# EAGLE schematic SP-PC-1 (EAGLE 7.6.0)

## Sheet 1 of 8: SP
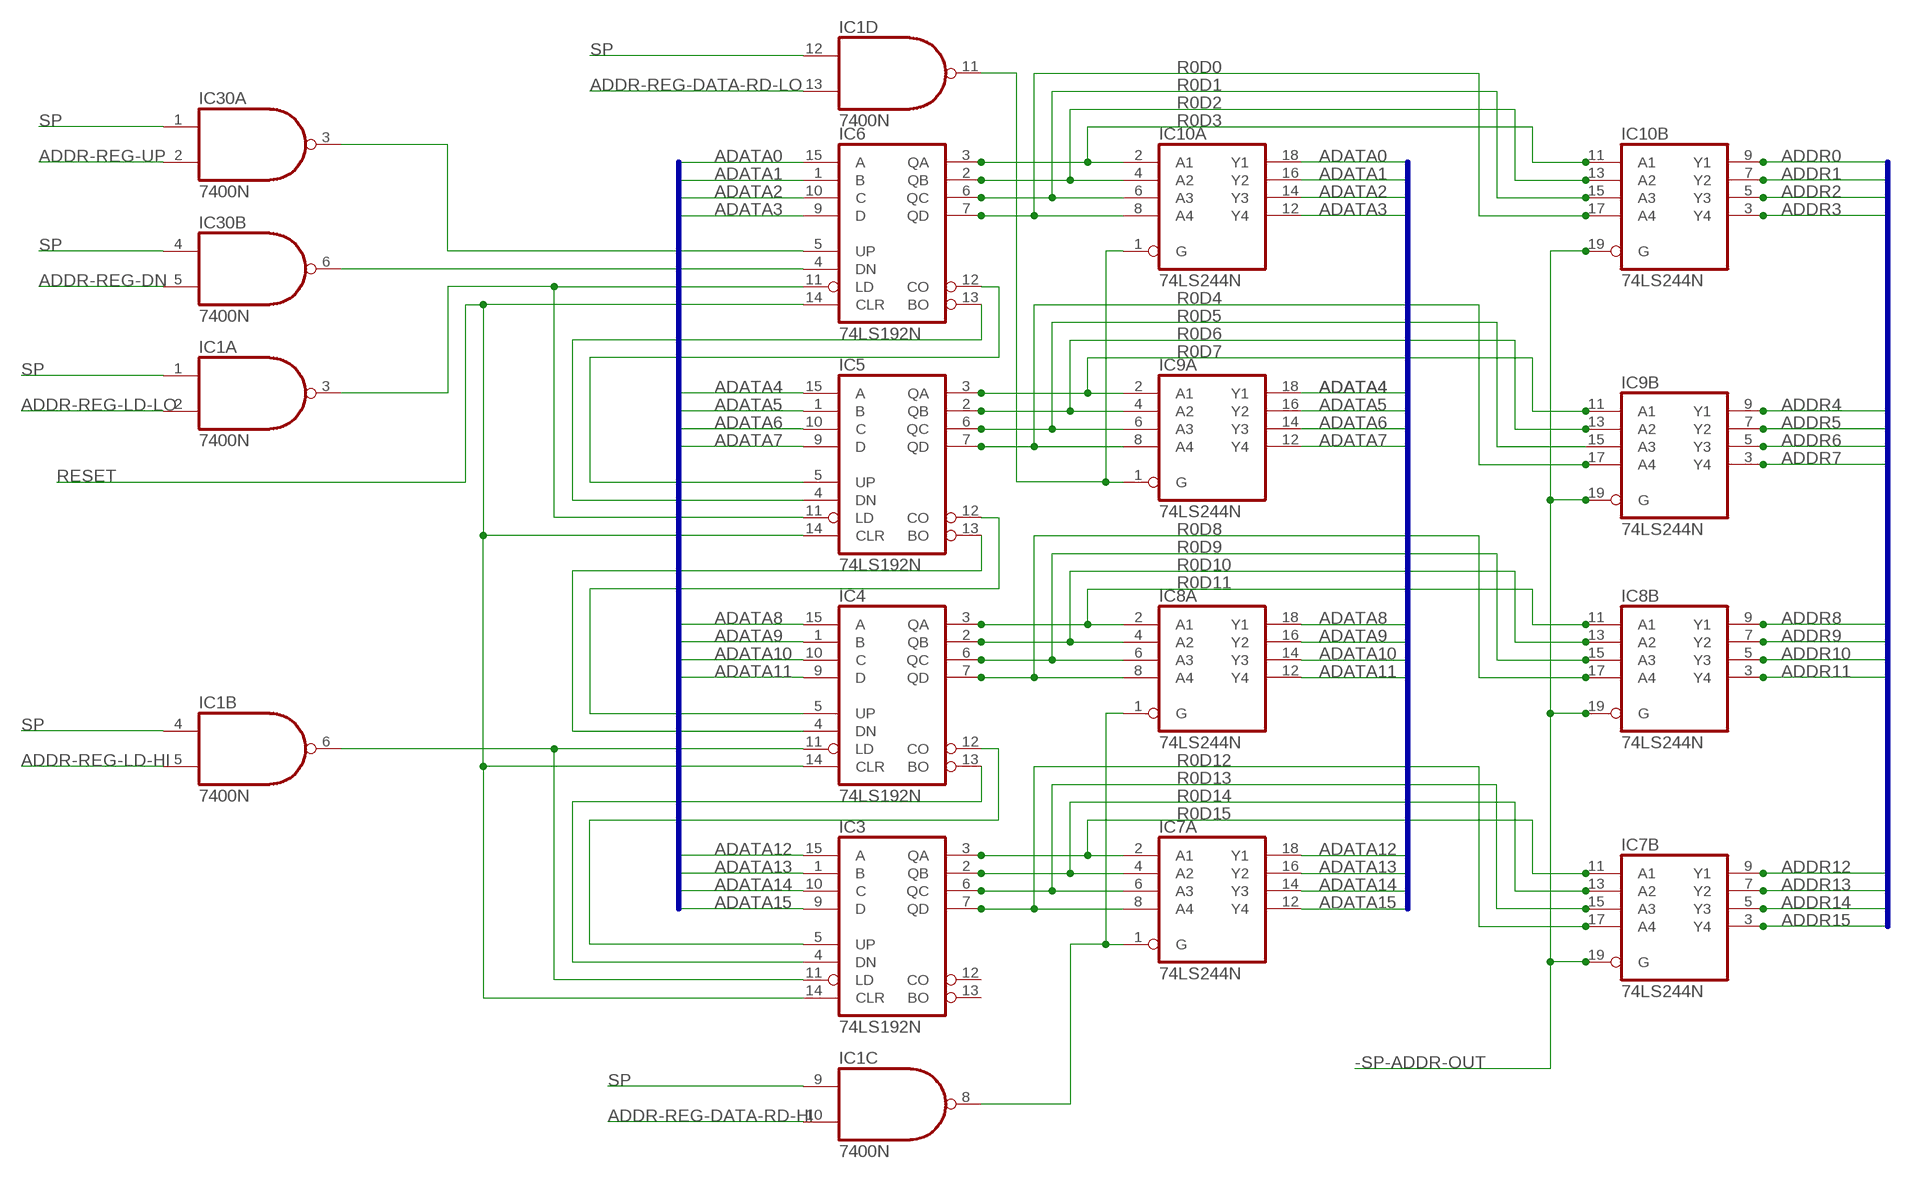
[diagram p0: schematic, sheet 1]

### Parts
IC1  7400N  [DIL14]
IC3  74LS192N  [DIL16]
IC4  74LS192N  [DIL16]
IC5  74LS192N  [DIL16]
IC6  74LS192N  [DIL16]
IC7  74LS244N  [DIL20]
IC8  74LS244N  [DIL20]
IC9  74LS244N  [DIL20]
IC10  74LS244N  [DIL20]
IC30  7400N  [DIL14]

### Nets
-SP-ADDR-OUT: IC7.19(B:G) IC8.19(B:G) IC9.19(B:G) IC10.19(B:G) ; also sheet 5
ADATA0: IC6.15(A) IC10.18(A:Y1) ; also sheet 2,3,4,5,7
ADATA1: IC6.1(B) IC10.16(A:Y2) ; also sheet 2,3,4,5,7
ADATA2: IC6.10(C) IC10.14(A:Y3) ; also sheet 2,3,4,5,7
ADATA3: IC6.9(D) IC10.12(A:Y4) ; also sheet 2,3,4,5,7
ADATA4: IC5.15(A) IC9.18(A:Y1) ; also sheet 2,3,4,5,7
ADATA5: IC5.1(B) IC9.16(A:Y2) ; also sheet 2,3,4,5,7
ADATA6: IC5.10(C) IC9.14(A:Y3) ; also sheet 2,3,4,5,7
ADATA7: IC5.9(D) IC9.12(A:Y4) ; also sheet 2,3,4,5,7
ADATA8: IC4.15(A) IC8.18(A:Y1) ; also sheet 2,3,4,5,7
ADATA9: IC4.1(B) IC8.16(A:Y2) ; also sheet 2,3,4,5,7
ADATA10: IC4.10(C) IC8.14(A:Y3) ; also sheet 2,3,4,5,7
ADATA11: IC4.9(D) IC8.12(A:Y4) ; also sheet 2,3,4,5,7
ADATA12: IC3.15(A) IC7.18(A:Y1) ; also sheet 2,3,4,5,7
ADATA13: IC3.1(B) IC7.16(A:Y2) ; also sheet 2,3,4,5,7
ADATA14: IC3.10(C) IC7.14(A:Y3) ; also sheet 2,3,4,5,7
ADATA15: IC3.9(D) IC7.12(A:Y4) ; also sheet 2,3,4,5,7
ADDR0: IC10.9(B:Y1) ; also sheet 2,3,4,8
ADDR1: IC10.7(B:Y2) ; also sheet 2,3,4,8
ADDR2: IC10.5(B:Y3) ; also sheet 2,3,4,8
ADDR3: IC10.3(B:Y4) ; also sheet 2,3,4,8
ADDR4: IC9.9(B:Y1) ; also sheet 2,3,4,8
ADDR5: IC9.7(B:Y2) ; also sheet 2,3,4,8
ADDR6: IC9.5(B:Y3) ; also sheet 2,3,4,8
ADDR7: IC9.3(B:Y4) ; also sheet 2,3,4,8
ADDR8: IC8.9(B:Y1) ; also sheet 2,3,4,8
ADDR9: IC8.7(B:Y2) ; also sheet 2,3,4,8
ADDR10: IC8.5(B:Y3) ; also sheet 2,3,4,8
ADDR11: IC8.3(B:Y4) ; also sheet 2,3,4,8
ADDR12: IC7.9(B:Y1) ; also sheet 2,3,4,8
ADDR13: IC7.7(B:Y2) ; also sheet 2,3,4,8
ADDR14: IC7.5(B:Y3) ; also sheet 2,3,4,8
ADDR15: IC7.3(B:Y4) ; also sheet 2,3,4,8
ADDR-REG-DATA-RD-HI: IC1.10(C:I1) ; also sheet 2,3,4,8
ADDR-REG-DATA-RD-LO: IC1.13(D:I1) ; also sheet 2,3,4,8
ADDR-REG-DN: IC30.5(B:I1) ; also sheet 2,3,4,8
ADDR-REG-LD-HI: IC1.5(B:I1) ; also sheet 2,3,4,8
ADDR-REG-LD-LO: IC1.2(A:I1) ; also sheet 2,3,4,8
ADDR-REG-UP: IC30.2(A:I1) ; also sheet 2,3,4,8
N$10: IC5.4(DN) IC6.13(BO)
N$11: IC5.5(UP) IC6.12(CO)
N$12: IC4.4(DN) IC5.13(BO)
N$13: IC4.5(UP) IC5.12(CO)
N$14: IC3.4(DN) IC4.13(BO)
N$15: IC3.5(UP) IC4.12(CO)
N$16: IC1.3(A:O) IC5.11(LD) IC6.11(LD)
N$17: IC6.5(UP) IC30.3(A:O)
N$18: IC6.4(DN) IC30.6(B:O)
N$20: IC1.11(D:O) IC9.1(A:G) IC10.1(A:G)
N$21: IC1.8(C:O) IC7.1(A:G) IC8.1(A:G)
N$22: IC1.6(B:O) IC3.11(LD) IC4.11(LD)
R0D0: IC6.7(QD) IC10.8(A:A4) IC10.17(B:A4) ; also sheet 6
R0D1: IC6.6(QC) IC10.6(A:A3) IC10.15(B:A3) ; also sheet 6
R0D2: IC6.2(QB) IC10.4(A:A2) IC10.13(B:A2) ; also sheet 6
R0D3: IC6.3(QA) IC10.2(A:A1) IC10.11(B:A1) ; also sheet 6
R0D4: IC5.7(QD) IC9.8(A:A4) IC9.17(B:A4) ; also sheet 6
R0D5: IC5.6(QC) IC9.6(A:A3) IC9.15(B:A3) ; also sheet 6
R0D6: IC5.2(QB) IC9.4(A:A2) IC9.13(B:A2) ; also sheet 6
R0D7: IC5.3(QA) IC9.2(A:A1) IC9.11(B:A1) ; also sheet 6
R0D8: IC4.7(QD) IC8.8(A:A4) IC8.17(B:A4) ; also sheet 6
R0D9: IC4.6(QC) IC8.6(A:A3) IC8.15(B:A3) ; also sheet 6
R0D10: IC4.2(QB) IC8.4(A:A2) IC8.13(B:A2) ; also sheet 6
R0D11: IC4.3(QA) IC8.2(A:A1) IC8.11(B:A1) ; also sheet 6
R0D12: IC3.7(QD) IC7.8(A:A4) IC7.17(B:A4) ; also sheet 6
R0D13: IC3.6(QC) IC7.6(A:A3) IC7.15(B:A3) ; also sheet 6
R0D14: IC3.2(QB) IC7.4(A:A2) IC7.13(B:A2) ; also sheet 6
R0D15: IC3.3(QA) IC7.2(A:A1) IC7.11(B:A1) ; also sheet 6
RESET: IC3.14(CLR) IC4.14(CLR) IC5.14(CLR) IC6.14(CLR) ; also sheet 2,3,4,8
SP: IC1.1(A:I0) IC1.4(B:I0) IC1.9(C:I0) IC1.12(D:I0) IC30.1(A:I0) IC30.4(B:I0) ; also sheet 5
Unconnected: IC3.12(CO) IC3.13(BO)

### Buses
ADDR[0..15]
ADATA[0..15]

## Sheet 2 of 8: INDIRECT 0
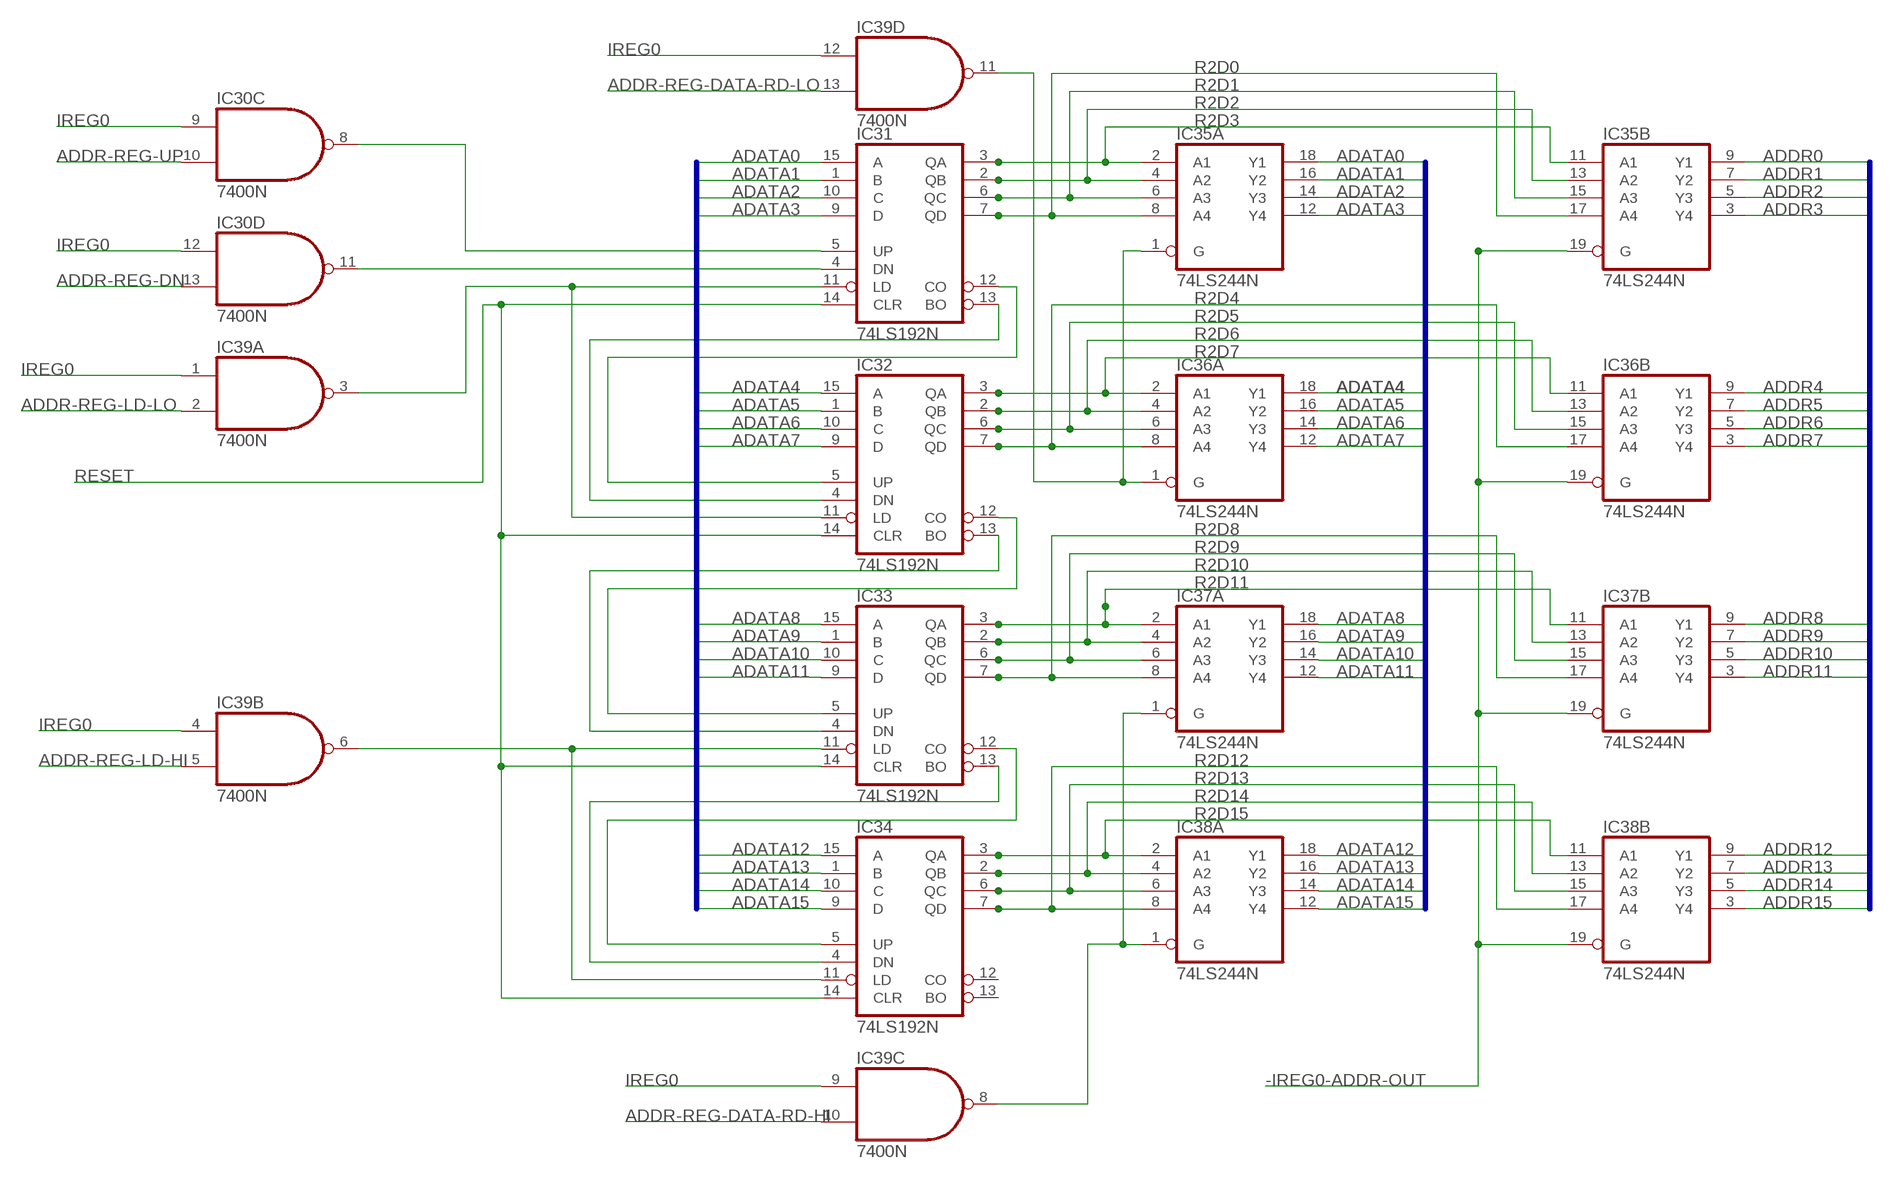
[diagram p1: schematic, sheet 2]

### Parts
IC31  74LS192N  [DIL16]
IC32  74LS192N  [DIL16]
IC33  74LS192N  [DIL16]
IC34  74LS192N  [DIL16]
IC35  74LS244N  [DIL20]
IC36  74LS244N  [DIL20]
IC37  74LS244N  [DIL20]
IC38  74LS244N  [DIL20]
IC39  7400N  [DIL14]

### Nets
-IREG0-ADDR-OUT: IC35.19(B:G) IC36.19(B:G) IC37.19(B:G) IC38.19(B:G) ; also sheet 5
ADATA0: IC31.15(A) IC35.18(A:Y1) ; also sheet 1,3,4,5,7
ADATA1: IC31.1(B) IC35.16(A:Y2) ; also sheet 1,3,4,5,7
ADATA2: IC31.10(C) IC35.14(A:Y3) ; also sheet 1,3,4,5,7
ADATA3: IC31.9(D) IC35.12(A:Y4) ; also sheet 1,3,4,5,7
ADATA4: IC32.15(A) IC36.18(A:Y1) ; also sheet 1,3,4,5,7
ADATA5: IC32.1(B) IC36.16(A:Y2) ; also sheet 1,3,4,5,7
ADATA6: IC32.10(C) IC36.14(A:Y3) ; also sheet 1,3,4,5,7
ADATA7: IC32.9(D) IC36.12(A:Y4) ; also sheet 1,3,4,5,7
ADATA8: IC33.15(A) IC37.18(A:Y1) ; also sheet 1,3,4,5,7
ADATA9: IC33.1(B) IC37.16(A:Y2) ; also sheet 1,3,4,5,7
ADATA10: IC33.10(C) IC37.14(A:Y3) ; also sheet 1,3,4,5,7
ADATA11: IC33.9(D) IC37.12(A:Y4) ; also sheet 1,3,4,5,7
ADATA12: IC34.15(A) IC38.18(A:Y1) ; also sheet 1,3,4,5,7
ADATA13: IC34.1(B) IC38.16(A:Y2) ; also sheet 1,3,4,5,7
ADATA14: IC34.10(C) IC38.14(A:Y3) ; also sheet 1,3,4,5,7
ADATA15: IC34.9(D) IC38.12(A:Y4) ; also sheet 1,3,4,5,7
ADDR0: IC35.9(B:Y1) ; also sheet 1,3,4,8
ADDR1: IC35.7(B:Y2) ; also sheet 1,3,4,8
ADDR2: IC35.5(B:Y3) ; also sheet 1,3,4,8
ADDR3: IC35.3(B:Y4) ; also sheet 1,3,4,8
ADDR4: IC36.9(B:Y1) ; also sheet 1,3,4,8
ADDR5: IC36.7(B:Y2) ; also sheet 1,3,4,8
ADDR6: IC36.5(B:Y3) ; also sheet 1,3,4,8
ADDR7: IC36.3(B:Y4) ; also sheet 1,3,4,8
ADDR8: IC37.9(B:Y1) ; also sheet 1,3,4,8
ADDR9: IC37.7(B:Y2) ; also sheet 1,3,4,8
ADDR10: IC37.5(B:Y3) ; also sheet 1,3,4,8
ADDR11: IC37.3(B:Y4) ; also sheet 1,3,4,8
ADDR12: IC38.9(B:Y1) ; also sheet 1,3,4,8
ADDR13: IC38.7(B:Y2) ; also sheet 1,3,4,8
ADDR14: IC38.5(B:Y3) ; also sheet 1,3,4,8
ADDR15: IC38.3(B:Y4) ; also sheet 1,3,4,8
ADDR-REG-DATA-RD-HI: IC39.10(C:I1) ; also sheet 1,3,4,8
ADDR-REG-DATA-RD-LO: IC39.13(D:I1) ; also sheet 1,3,4,8
ADDR-REG-DN: IC30.13(D:I1) ; also sheet 1,3,4,8
ADDR-REG-LD-HI: IC39.5(B:I1) ; also sheet 1,3,4,8
ADDR-REG-LD-LO: IC39.2(A:I1) ; also sheet 1,3,4,8
ADDR-REG-UP: IC30.10(C:I1) ; also sheet 1,3,4,8
IREG0: IC30.9(C:I0) IC30.12(D:I0) IC39.1(A:I0) IC39.4(B:I0) IC39.9(C:I0) IC39.12(D:I0) ; also sheet 5
N$28: IC31.13(BO) IC32.4(DN)
N$29: IC31.12(CO) IC32.5(UP)
N$30: IC32.13(BO) IC33.4(DN)
N$31: IC32.12(CO) IC33.5(UP)
N$32: IC33.13(BO) IC34.4(DN)
N$33: IC33.12(CO) IC34.5(UP)
N$34: IC31.11(LD) IC32.11(LD) IC39.3(A:O)
N$35: IC30.8(C:O) IC31.5(UP)
N$36: IC30.11(D:O) IC31.4(DN)
N$38: IC35.1(A:G) IC36.1(A:G) IC39.11(D:O)
N$39: IC37.1(A:G) IC38.1(A:G) IC39.8(C:O)
N$40: IC33.11(LD) IC34.11(LD) IC39.6(B:O)
R2D0: IC31.7(QD) IC35.8(A:A4) IC35.17(B:A4) ; also sheet 6
R2D1: IC31.6(QC) IC35.6(A:A3) IC35.15(B:A3) ; also sheet 6
R2D2: IC31.2(QB) IC35.4(A:A2) IC35.13(B:A2) ; also sheet 6
R2D3: IC31.3(QA) IC35.2(A:A1) IC35.11(B:A1) ; also sheet 6
R2D4: IC32.7(QD) IC36.8(A:A4) IC36.17(B:A4) ; also sheet 6
R2D5: IC32.6(QC) IC36.6(A:A3) IC36.15(B:A3) ; also sheet 6
R2D6: IC32.2(QB) IC36.4(A:A2) IC36.13(B:A2) ; also sheet 6
R2D7: IC32.3(QA) IC36.2(A:A1) IC36.11(B:A1) ; also sheet 6
R2D8: IC33.7(QD) IC37.8(A:A4) IC37.17(B:A4) ; also sheet 6
R2D9: IC33.6(QC) IC37.6(A:A3) IC37.15(B:A3) ; also sheet 6
R2D10: IC33.2(QB) IC37.4(A:A2) IC37.13(B:A2) ; also sheet 6
R2D11: IC33.3(QA) IC37.2(A:A1) IC37.11(B:A1) ; also sheet 6
R2D12: IC34.7(QD) IC38.8(A:A4) IC38.17(B:A4) ; also sheet 6
R2D13: IC34.6(QC) IC38.6(A:A3) IC38.15(B:A3) ; also sheet 6
R2D14: IC34.2(QB) IC38.4(A:A2) IC38.13(B:A2) ; also sheet 6
R2D15: IC34.3(QA) IC38.2(A:A1) IC38.11(B:A1) ; also sheet 6
RESET: IC31.14(CLR) IC32.14(CLR) IC33.14(CLR) IC34.14(CLR) ; also sheet 1,3,4,8
Unconnected: IC34.12(CO) IC34.13(BO)

### Buses
ADDR[0..15]
ADATA[0..15]

## Sheet 3 of 8: PC
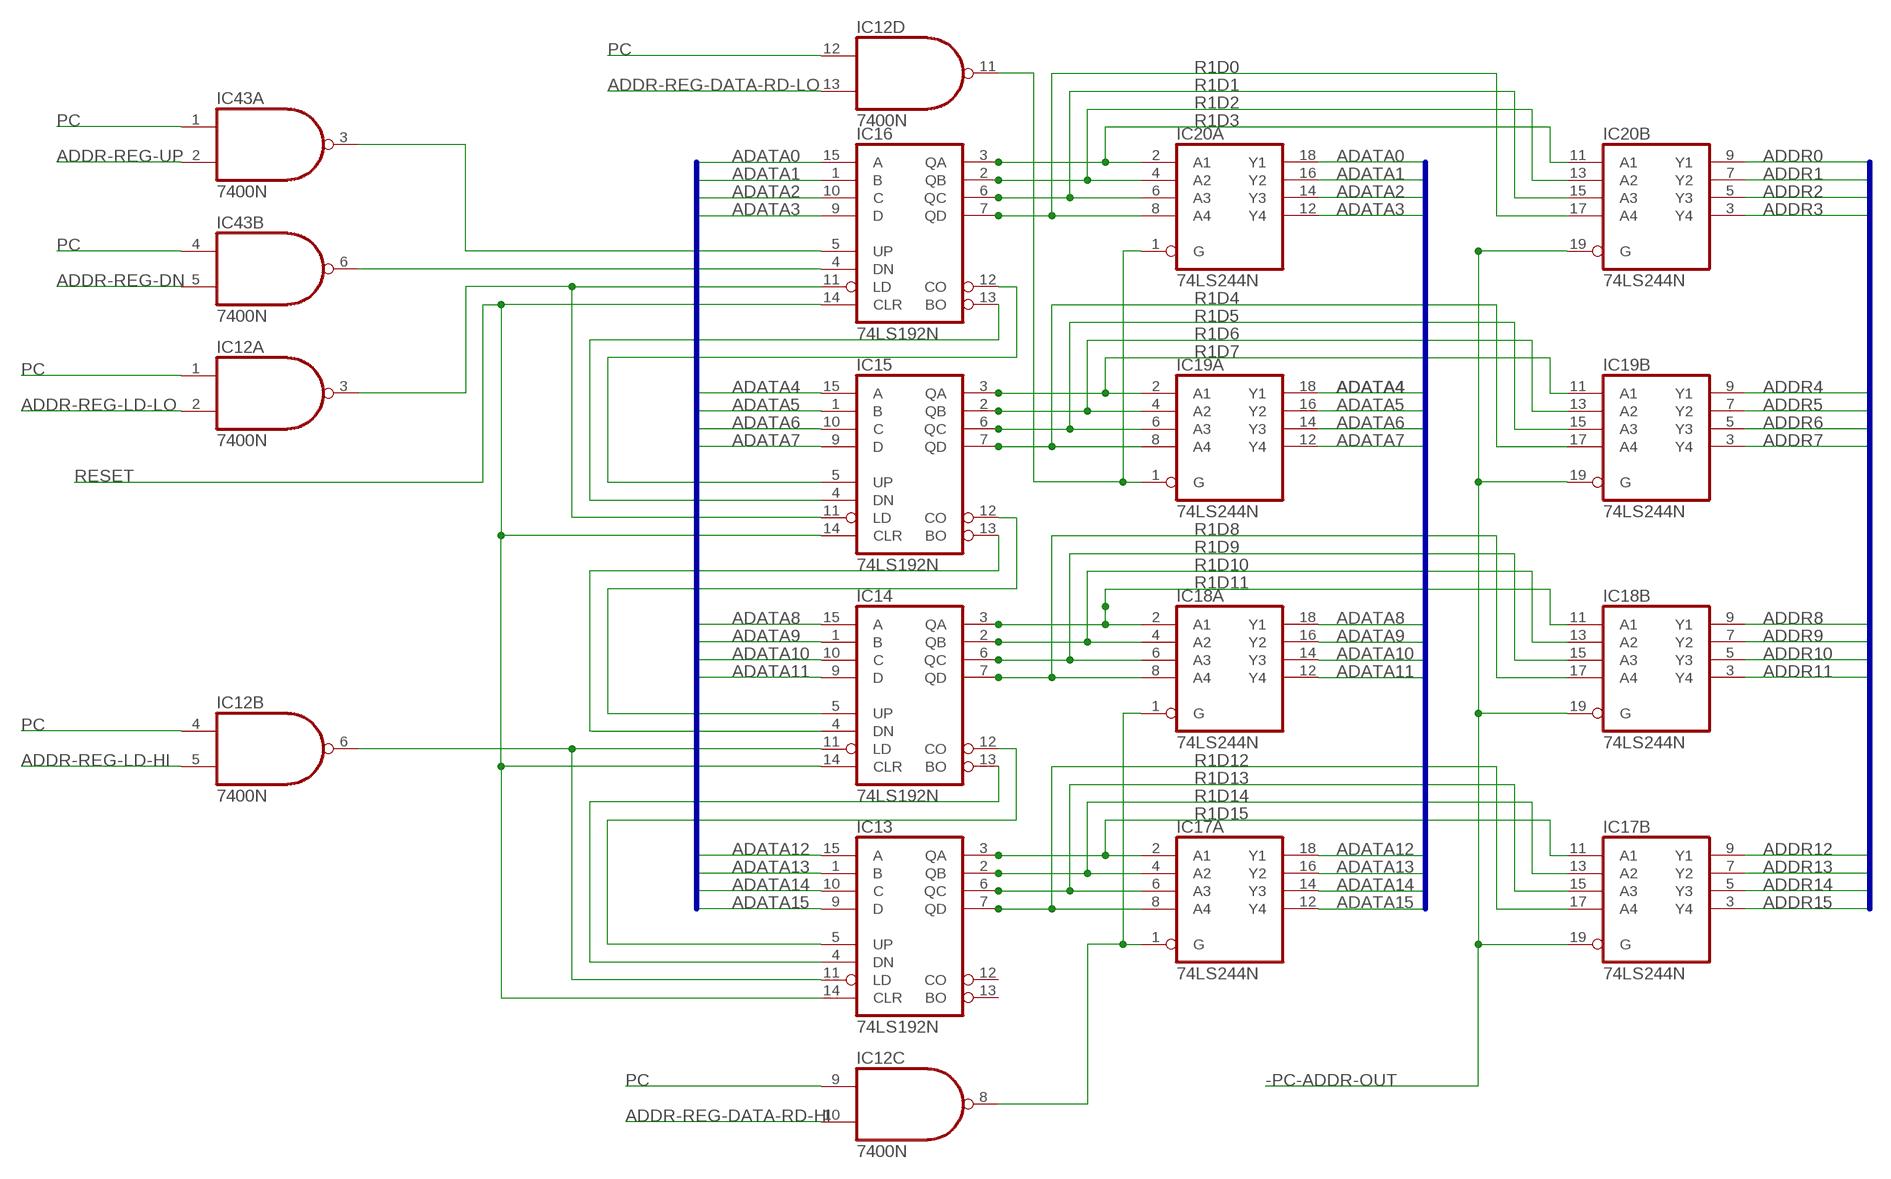
[diagram p2: schematic, sheet 3]

### Parts
IC12  7400N  [DIL14]
IC13  74LS192N  [DIL16]
IC14  74LS192N  [DIL16]
IC15  74LS192N  [DIL16]
IC16  74LS192N  [DIL16]
IC17  74LS244N  [DIL20]
IC18  74LS244N  [DIL20]
IC19  74LS244N  [DIL20]
IC20  74LS244N  [DIL20]
IC43  7400N  [DIL14]

### Nets
-PC-ADDR-OUT: IC17.19(B:G) IC18.19(B:G) IC19.19(B:G) IC20.19(B:G) ; also sheet 5
ADATA0: IC16.15(A) IC20.18(A:Y1) ; also sheet 1,2,4,5,7
ADATA1: IC16.1(B) IC20.16(A:Y2) ; also sheet 1,2,4,5,7
ADATA2: IC16.10(C) IC20.14(A:Y3) ; also sheet 1,2,4,5,7
ADATA3: IC16.9(D) IC20.12(A:Y4) ; also sheet 1,2,4,5,7
ADATA4: IC15.15(A) IC19.18(A:Y1) ; also sheet 1,2,4,5,7
ADATA5: IC15.1(B) IC19.16(A:Y2) ; also sheet 1,2,4,5,7
ADATA6: IC15.10(C) IC19.14(A:Y3) ; also sheet 1,2,4,5,7
ADATA7: IC15.9(D) IC19.12(A:Y4) ; also sheet 1,2,4,5,7
ADATA8: IC14.15(A) IC18.18(A:Y1) ; also sheet 1,2,4,5,7
ADATA9: IC14.1(B) IC18.16(A:Y2) ; also sheet 1,2,4,5,7
ADATA10: IC14.10(C) IC18.14(A:Y3) ; also sheet 1,2,4,5,7
ADATA11: IC14.9(D) IC18.12(A:Y4) ; also sheet 1,2,4,5,7
ADATA12: IC13.15(A) IC17.18(A:Y1) ; also sheet 1,2,4,5,7
ADATA13: IC13.1(B) IC17.16(A:Y2) ; also sheet 1,2,4,5,7
ADATA14: IC13.10(C) IC17.14(A:Y3) ; also sheet 1,2,4,5,7
ADATA15: IC13.9(D) IC17.12(A:Y4) ; also sheet 1,2,4,5,7
ADDR0: IC20.9(B:Y1) ; also sheet 1,2,4,8
ADDR1: IC20.7(B:Y2) ; also sheet 1,2,4,8
ADDR2: IC20.5(B:Y3) ; also sheet 1,2,4,8
ADDR3: IC20.3(B:Y4) ; also sheet 1,2,4,8
ADDR4: IC19.9(B:Y1) ; also sheet 1,2,4,8
ADDR5: IC19.7(B:Y2) ; also sheet 1,2,4,8
ADDR6: IC19.5(B:Y3) ; also sheet 1,2,4,8
ADDR7: IC19.3(B:Y4) ; also sheet 1,2,4,8
ADDR8: IC18.9(B:Y1) ; also sheet 1,2,4,8
ADDR9: IC18.7(B:Y2) ; also sheet 1,2,4,8
ADDR10: IC18.5(B:Y3) ; also sheet 1,2,4,8
ADDR11: IC18.3(B:Y4) ; also sheet 1,2,4,8
ADDR12: IC17.9(B:Y1) ; also sheet 1,2,4,8
ADDR13: IC17.7(B:Y2) ; also sheet 1,2,4,8
ADDR14: IC17.5(B:Y3) ; also sheet 1,2,4,8
ADDR15: IC17.3(B:Y4) ; also sheet 1,2,4,8
ADDR-REG-DATA-RD-HI: IC12.10(C:I1) ; also sheet 1,2,4,8
ADDR-REG-DATA-RD-LO: IC12.13(D:I1) ; also sheet 1,2,4,8
ADDR-REG-DN: IC43.5(B:I1) ; also sheet 1,2,4,8
ADDR-REG-LD-HI: IC12.5(B:I1) ; also sheet 1,2,4,8
ADDR-REG-LD-LO: IC12.2(A:I1) ; also sheet 1,2,4,8
ADDR-REG-UP: IC43.2(A:I1) ; also sheet 1,2,4,8
N$58: IC15.4(DN) IC16.13(BO)
N$59: IC15.5(UP) IC16.12(CO)
N$60: IC14.4(DN) IC15.13(BO)
N$61: IC14.5(UP) IC15.12(CO)
N$62: IC13.4(DN) IC14.13(BO)
N$63: IC13.5(UP) IC14.12(CO)
N$64: IC12.3(A:O) IC15.11(LD) IC16.11(LD)
N$65: IC16.5(UP) IC43.3(A:O)
N$66: IC16.4(DN) IC43.6(B:O)
N$84: IC12.11(D:O) IC19.1(A:G) IC20.1(A:G)
N$85: IC12.8(C:O) IC17.1(A:G) IC18.1(A:G)
N$86: IC12.6(B:O) IC13.11(LD) IC14.11(LD)
PC: IC12.1(A:I0) IC12.4(B:I0) IC12.9(C:I0) IC12.12(D:I0) IC43.1(A:I0) IC43.4(B:I0) ; also sheet 5
R1D0: IC16.7(QD) IC20.8(A:A4) IC20.17(B:A4) ; also sheet 6
R1D1: IC16.6(QC) IC20.6(A:A3) IC20.15(B:A3) ; also sheet 6
R1D2: IC16.2(QB) IC20.4(A:A2) IC20.13(B:A2) ; also sheet 6
R1D3: IC16.3(QA) IC20.2(A:A1) IC20.11(B:A1) ; also sheet 6
R1D4: IC15.7(QD) IC19.8(A:A4) IC19.17(B:A4) ; also sheet 6
R1D5: IC15.6(QC) IC19.6(A:A3) IC19.15(B:A3) ; also sheet 6
R1D6: IC15.2(QB) IC19.4(A:A2) IC19.13(B:A2) ; also sheet 6
R1D7: IC15.3(QA) IC19.2(A:A1) IC19.11(B:A1) ; also sheet 6
R1D8: IC14.7(QD) IC18.8(A:A4) IC18.17(B:A4) ; also sheet 6
R1D9: IC14.6(QC) IC18.6(A:A3) IC18.15(B:A3) ; also sheet 6
R1D10: IC14.2(QB) IC18.4(A:A2) IC18.13(B:A2) ; also sheet 6
R1D11: IC14.3(QA) IC18.2(A:A1) IC18.11(B:A1) ; also sheet 6
R1D12: IC13.7(QD) IC17.8(A:A4) IC17.17(B:A4) ; also sheet 6
R1D13: IC13.6(QC) IC17.6(A:A3) IC17.15(B:A3) ; also sheet 6
R1D14: IC13.2(QB) IC17.4(A:A2) IC17.13(B:A2) ; also sheet 6
R1D15: IC13.3(QA) IC17.2(A:A1) IC17.11(B:A1) ; also sheet 6
RESET: IC13.14(CLR) IC14.14(CLR) IC15.14(CLR) IC16.14(CLR) ; also sheet 1,2,4,8
Unconnected: IC13.12(CO) IC13.13(BO)

### Buses
ADDR[0..15]
ADATA[0..15]

## Sheet 4 of 8: INDIRECT 1
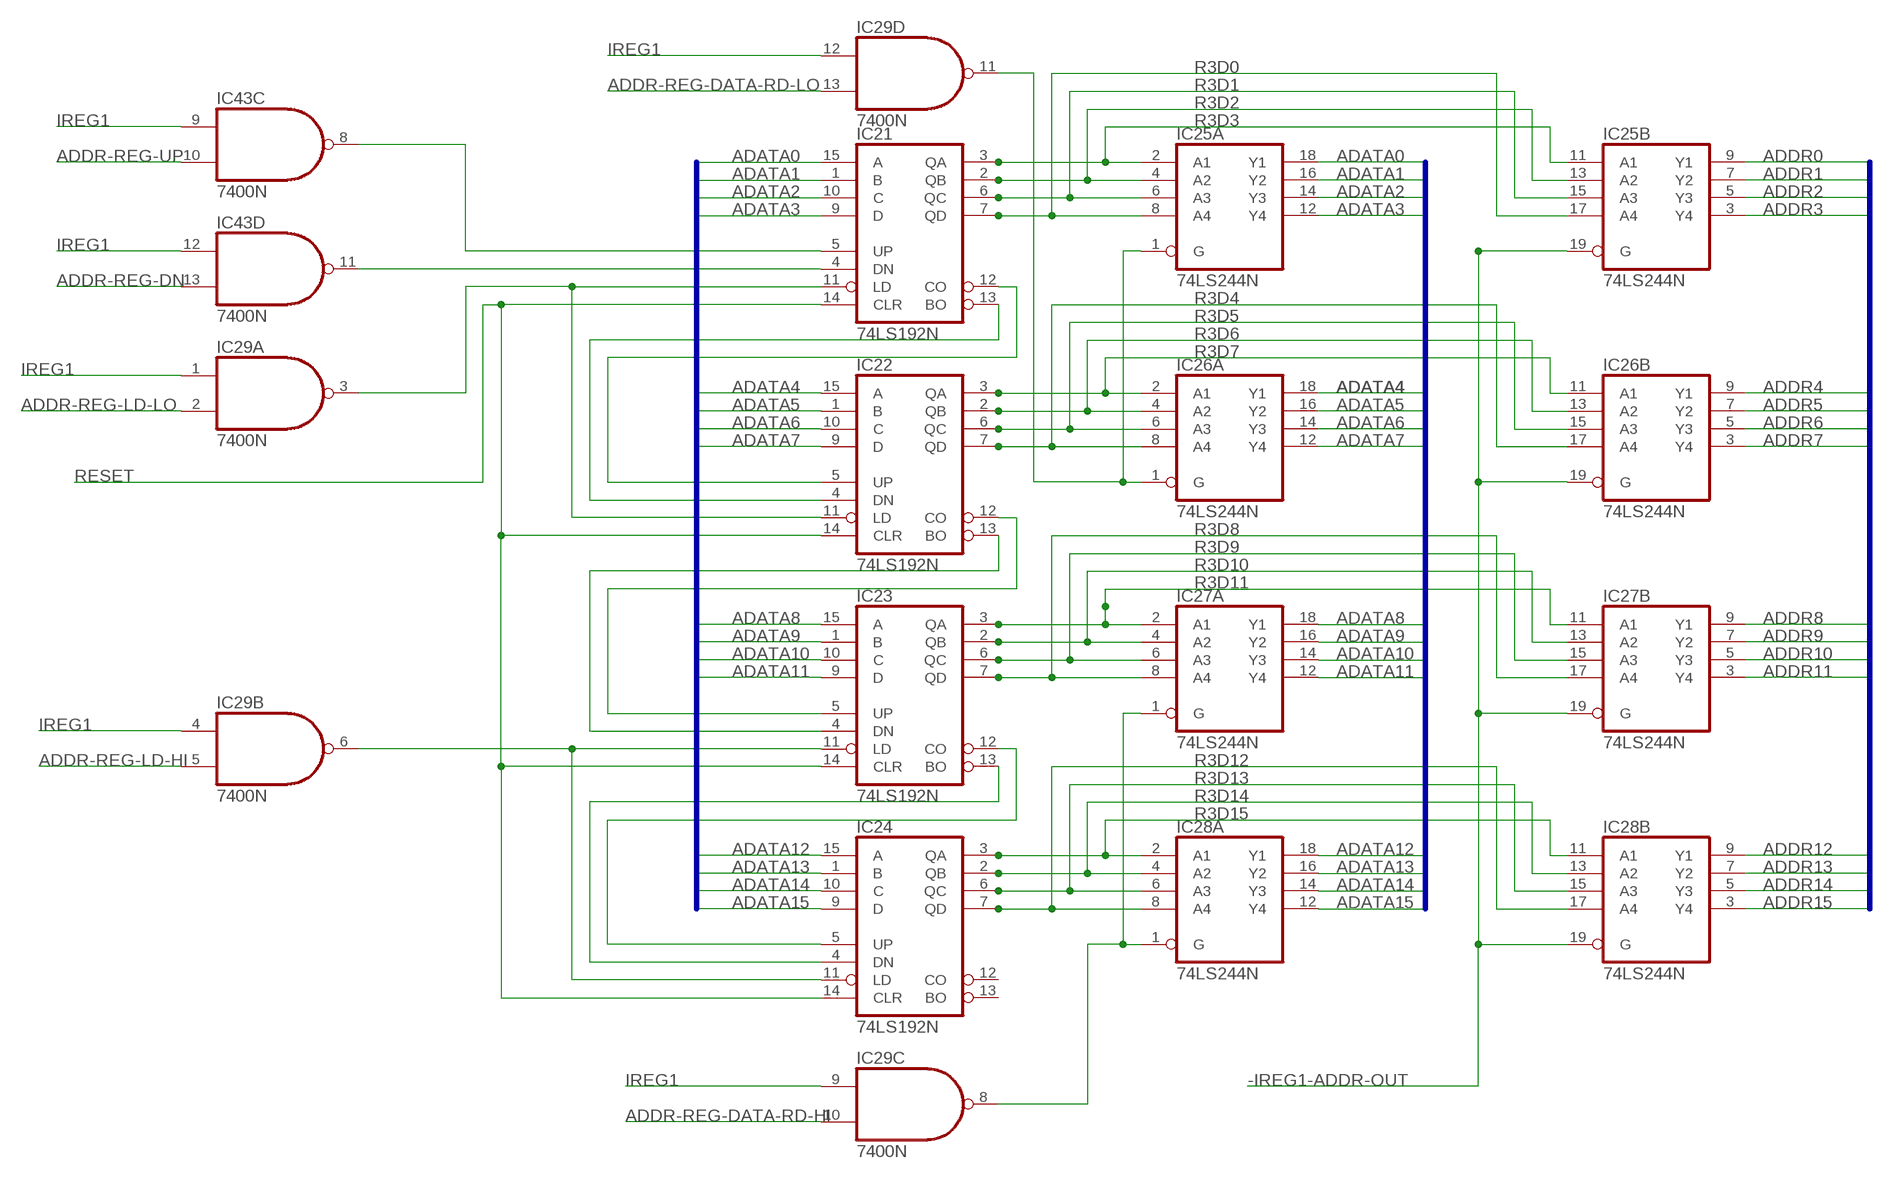
[diagram p3: schematic, sheet 4]

### Parts
IC21  74LS192N  [DIL16]
IC22  74LS192N  [DIL16]
IC23  74LS192N  [DIL16]
IC24  74LS192N  [DIL16]
IC25  74LS244N  [DIL20]
IC26  74LS244N  [DIL20]
IC27  74LS244N  [DIL20]
IC28  74LS244N  [DIL20]
IC29  7400N  [DIL14]

### Nets
-IREG1-ADDR-OUT: IC25.19(B:G) IC26.19(B:G) IC27.19(B:G) IC28.19(B:G) ; also sheet 5
ADATA0: IC21.15(A) IC25.18(A:Y1) ; also sheet 1,2,3,5,7
ADATA1: IC21.1(B) IC25.16(A:Y2) ; also sheet 1,2,3,5,7
ADATA2: IC21.10(C) IC25.14(A:Y3) ; also sheet 1,2,3,5,7
ADATA3: IC21.9(D) IC25.12(A:Y4) ; also sheet 1,2,3,5,7
ADATA4: IC22.15(A) IC26.18(A:Y1) ; also sheet 1,2,3,5,7
ADATA5: IC22.1(B) IC26.16(A:Y2) ; also sheet 1,2,3,5,7
ADATA6: IC22.10(C) IC26.14(A:Y3) ; also sheet 1,2,3,5,7
ADATA7: IC22.9(D) IC26.12(A:Y4) ; also sheet 1,2,3,5,7
ADATA8: IC23.15(A) IC27.18(A:Y1) ; also sheet 1,2,3,5,7
ADATA9: IC23.1(B) IC27.16(A:Y2) ; also sheet 1,2,3,5,7
ADATA10: IC23.10(C) IC27.14(A:Y3) ; also sheet 1,2,3,5,7
ADATA11: IC23.9(D) IC27.12(A:Y4) ; also sheet 1,2,3,5,7
ADATA12: IC24.15(A) IC28.18(A:Y1) ; also sheet 1,2,3,5,7
ADATA13: IC24.1(B) IC28.16(A:Y2) ; also sheet 1,2,3,5,7
ADATA14: IC24.10(C) IC28.14(A:Y3) ; also sheet 1,2,3,5,7
ADATA15: IC24.9(D) IC28.12(A:Y4) ; also sheet 1,2,3,5,7
ADDR0: IC25.9(B:Y1) ; also sheet 1,2,3,8
ADDR1: IC25.7(B:Y2) ; also sheet 1,2,3,8
ADDR2: IC25.5(B:Y3) ; also sheet 1,2,3,8
ADDR3: IC25.3(B:Y4) ; also sheet 1,2,3,8
ADDR4: IC26.9(B:Y1) ; also sheet 1,2,3,8
ADDR5: IC26.7(B:Y2) ; also sheet 1,2,3,8
ADDR6: IC26.5(B:Y3) ; also sheet 1,2,3,8
ADDR7: IC26.3(B:Y4) ; also sheet 1,2,3,8
ADDR8: IC27.9(B:Y1) ; also sheet 1,2,3,8
ADDR9: IC27.7(B:Y2) ; also sheet 1,2,3,8
ADDR10: IC27.5(B:Y3) ; also sheet 1,2,3,8
ADDR11: IC27.3(B:Y4) ; also sheet 1,2,3,8
ADDR12: IC28.9(B:Y1) ; also sheet 1,2,3,8
ADDR13: IC28.7(B:Y2) ; also sheet 1,2,3,8
ADDR14: IC28.5(B:Y3) ; also sheet 1,2,3,8
ADDR15: IC28.3(B:Y4) ; also sheet 1,2,3,8
ADDR-REG-DATA-RD-HI: IC29.10(C:I1) ; also sheet 1,2,3,8
ADDR-REG-DATA-RD-LO: IC29.13(D:I1) ; also sheet 1,2,3,8
ADDR-REG-DN: IC43.13(D:I1) ; also sheet 1,2,3,8
ADDR-REG-LD-HI: IC29.5(B:I1) ; also sheet 1,2,3,8
ADDR-REG-LD-LO: IC29.2(A:I1) ; also sheet 1,2,3,8
ADDR-REG-UP: IC43.10(C:I1) ; also sheet 1,2,3,8
IREG1: IC29.1(A:I0) IC29.4(B:I0) IC29.9(C:I0) IC29.12(D:I0) IC43.9(C:I0) IC43.12(D:I0) ; also sheet 5
N$2: IC21.13(BO) IC22.4(DN)
N$3: IC21.12(CO) IC22.5(UP)
N$4: IC22.13(BO) IC23.4(DN)
N$5: IC22.12(CO) IC23.5(UP)
N$6: IC23.13(BO) IC24.4(DN)
N$7: IC23.12(CO) IC24.5(UP)
N$8: IC21.11(LD) IC22.11(LD) IC29.3(A:O)
N$9: IC21.5(UP) IC43.8(C:O)
N$23: IC21.4(DN) IC43.11(D:O)
N$25: IC25.1(A:G) IC26.1(A:G) IC29.11(D:O)
N$26: IC27.1(A:G) IC28.1(A:G) IC29.8(C:O)
N$27: IC23.11(LD) IC24.11(LD) IC29.6(B:O)
R3D0: IC21.7(QD) IC25.8(A:A4) IC25.17(B:A4) ; also sheet 6
R3D1: IC21.6(QC) IC25.6(A:A3) IC25.15(B:A3) ; also sheet 6
R3D2: IC21.2(QB) IC25.4(A:A2) IC25.13(B:A2) ; also sheet 6
R3D3: IC21.3(QA) IC25.2(A:A1) IC25.11(B:A1) ; also sheet 6
R3D4: IC22.7(QD) IC26.8(A:A4) IC26.17(B:A4) ; also sheet 6
R3D5: IC22.6(QC) IC26.6(A:A3) IC26.15(B:A3) ; also sheet 6
R3D6: IC22.2(QB) IC26.4(A:A2) IC26.13(B:A2) ; also sheet 6
R3D7: IC22.3(QA) IC26.2(A:A1) IC26.11(B:A1) ; also sheet 6
R3D8: IC23.7(QD) IC27.8(A:A4) IC27.17(B:A4) ; also sheet 6
R3D9: IC23.6(QC) IC27.6(A:A3) IC27.15(B:A3) ; also sheet 6
R3D10: IC23.2(QB) IC27.4(A:A2) IC27.13(B:A2) ; also sheet 6
R3D11: IC23.3(QA) IC27.2(A:A1) IC27.11(B:A1) ; also sheet 6
R3D12: IC24.7(QD) IC28.8(A:A4) IC28.17(B:A4) ; also sheet 6
R3D13: IC24.6(QC) IC28.6(A:A3) IC28.15(B:A3) ; also sheet 6
R3D14: IC24.2(QB) IC28.4(A:A2) IC28.13(B:A2) ; also sheet 6
R3D15: IC24.3(QA) IC28.2(A:A1) IC28.11(B:A1) ; also sheet 6
RESET: IC21.14(CLR) IC22.14(CLR) IC23.14(CLR) IC24.14(CLR) ; also sheet 1,2,3,8
Unconnected: IC24.12(CO) IC24.13(BO)

### Buses
ADDR[0..15]
ADATA[0..15]

## Sheet 5 of 8: Bus Buffering
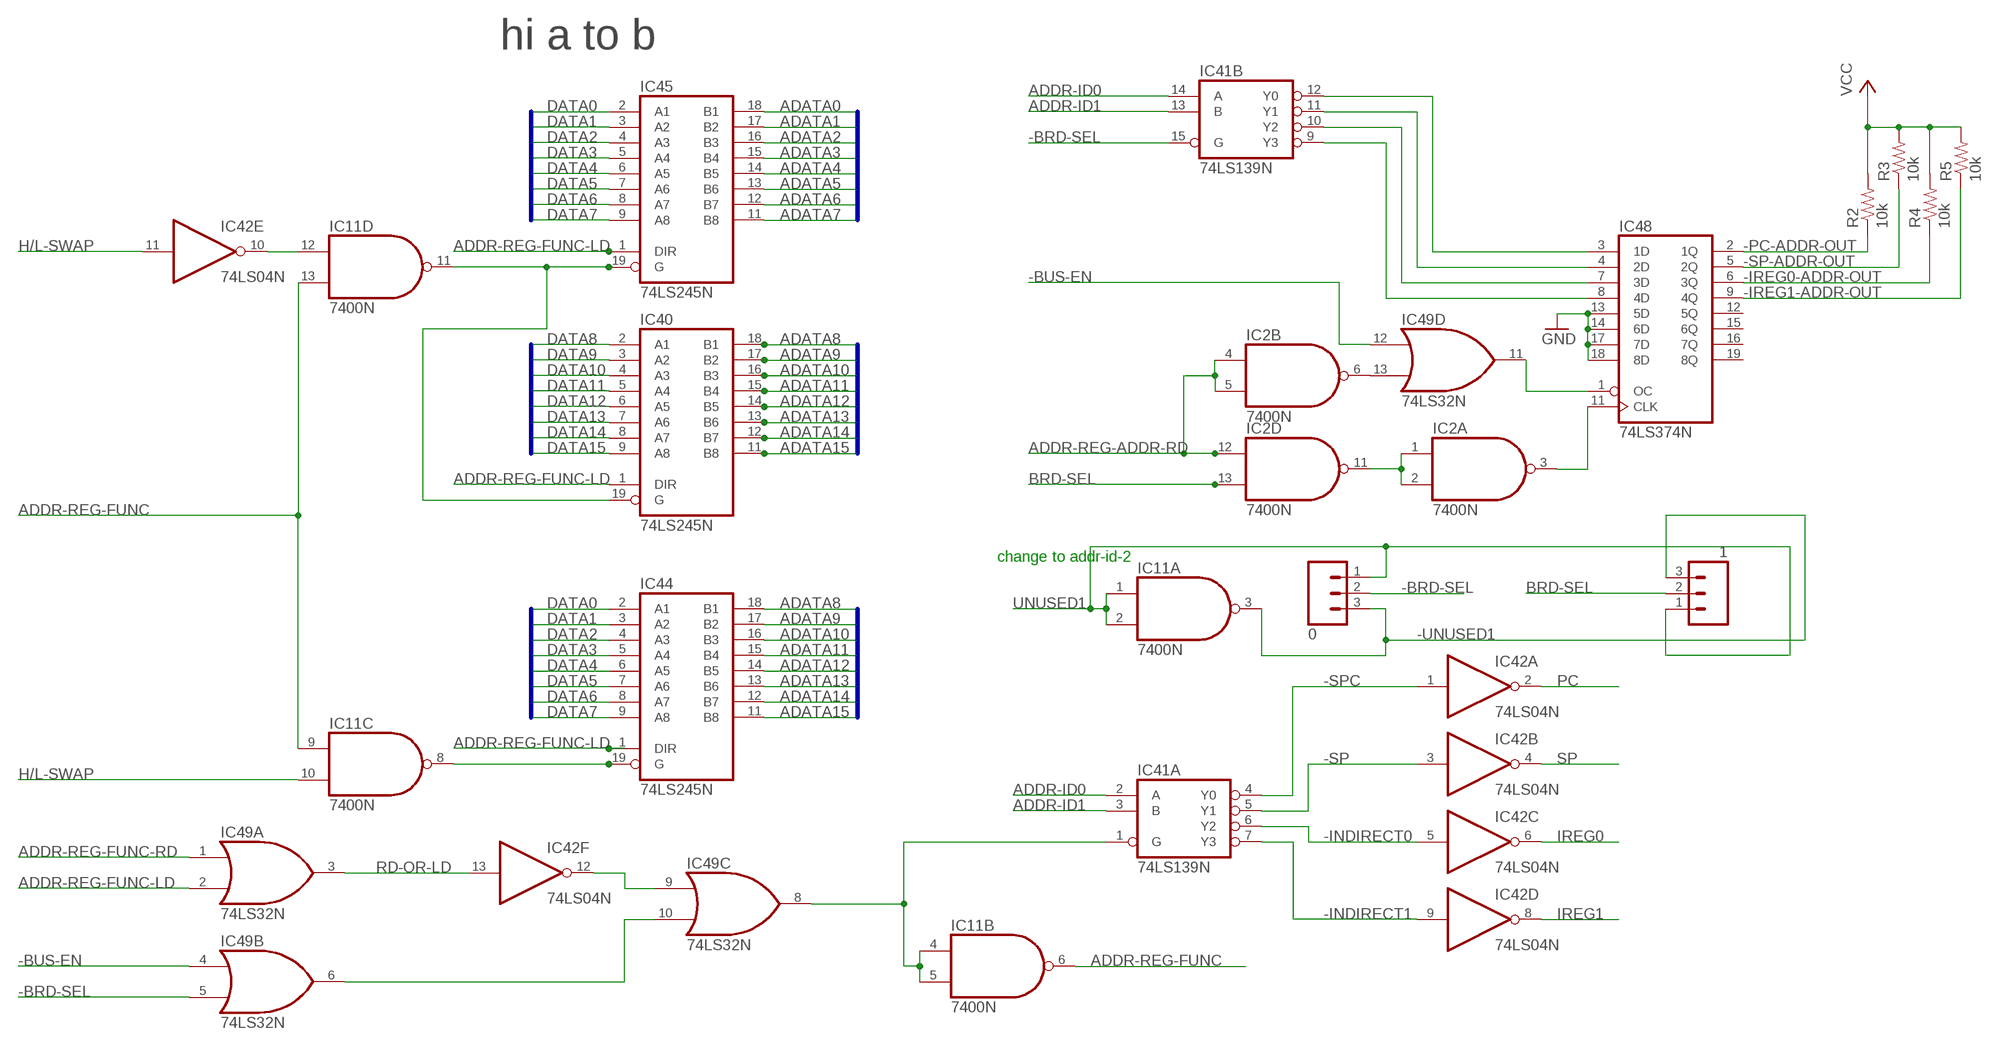
[diagram p4: schematic, sheet 5]

### Parts
0  M03PTH  [1X03]
1  M03PTH  [1X03]
IC2  7400N  [DIL14]
IC11  7400N  [DIL14]
IC40  74LS245N  [DIL20]
IC41  74LS139N  [DIL16]
IC42  74LS04N  [DIL14]
IC44  74LS245N  [DIL20]
IC45  74LS245N  [DIL20]
IC48  74LS374N  [DIL20]
IC49  74LS32N  [DIL14]
R2  10k  R-US_0207/10  [0207/10]
R3  10k  R-US_0207/10  [0207/10]
R4  10k  R-US_0207/10  [0207/10]
R5  10k  R-US_0207/10  [0207/10]

### Nets
-BRD-SEL: 0.2 IC41.15(B:G) IC49.5(B:I1)
-BUS-EN: IC49.4(B:I0) IC49.12(D:I0) ; also sheet 8
-INDIRECT0: IC41.6(A:Y2) IC42.5(C:I)
-INDIRECT1: IC41.7(A:Y3) IC42.9(D:I)
-IREG0-ADDR-OUT: IC48.6(3Q) R4.1 ; also sheet 2
-IREG1-ADDR-OUT: IC48.9(4Q) R5.1 ; also sheet 4
-PC-ADDR-OUT: IC48.2(1Q) R2.1 ; also sheet 3
-SP: IC41.5(A:Y1) IC42.3(B:I)
-SP-ADDR-OUT: IC48.5(2Q) R3.1 ; also sheet 1
-SPC: IC41.4(A:Y0) IC42.1(A:I)
-UNUSED1: 0.3 1.3 IC11.3(A:O)
ADATA0: IC45.18(B1) ; also sheet 1,2,3,4,7
ADATA1: IC45.17(B2) ; also sheet 1,2,3,4,7
ADATA2: IC45.16(B3) ; also sheet 1,2,3,4,7
ADATA3: IC45.15(B4) ; also sheet 1,2,3,4,7
ADATA4: IC45.14(B5) ; also sheet 1,2,3,4,7
ADATA5: IC45.13(B6) ; also sheet 1,2,3,4,7
ADATA6: IC45.12(B7) ; also sheet 1,2,3,4,7
ADATA7: IC45.11(B8) ; also sheet 1,2,3,4,7
ADATA8: IC40.18(B1) IC44.18(B1) ; also sheet 1,2,3,4,7
ADATA9: IC40.17(B2) IC44.17(B2) ; also sheet 1,2,3,4,7
ADATA10: IC40.16(B3) IC44.16(B3) ; also sheet 1,2,3,4,7
ADATA11: IC40.15(B4) IC44.15(B4) ; also sheet 1,2,3,4,7
ADATA12: IC40.14(B5) IC44.14(B5) ; also sheet 1,2,3,4,7
ADATA13: IC40.13(B6) IC44.13(B6) ; also sheet 1,2,3,4,7
ADATA14: IC40.12(B7) IC44.12(B7) ; also sheet 1,2,3,4,7
ADATA15: IC40.11(B8) IC44.11(B8) ; also sheet 1,2,3,4,7
ADDR-ID0: IC41.2(A:A) IC41.14(B:A) ; also sheet 8
ADDR-ID1: IC41.3(A:B) IC41.13(B:B) ; also sheet 8
ADDR-REG-ADDR-RD: IC2.4(B:I0) IC2.5(B:I1) IC2.12(D:I0) ; also sheet 8
ADDR-REG-FUNC: IC11.6(B:O) IC11.9(C:I0) IC11.13(D:I1)
ADDR-REG-FUNC-LD: IC40.1(DIR) IC44.1(DIR) IC45.1(DIR) IC49.2(A:I1) ; also sheet 8
ADDR-REG-FUNC-RD: IC49.1(A:I0) ; also sheet 8
BRD-SEL: 1.2 IC2.13(D:I1)
DATA0: IC44.2(A1) IC45.2(A1) ; also sheet 8
DATA1: IC44.3(A2) IC45.3(A2) ; also sheet 8
DATA2: IC44.4(A3) IC45.4(A3) ; also sheet 8
DATA3: IC44.5(A4) IC45.5(A4) ; also sheet 8
DATA4: IC44.6(A5) IC45.6(A5) ; also sheet 8
DATA5: IC44.7(A6) IC45.7(A6) ; also sheet 8
DATA6: IC44.8(A7) IC45.8(A7) ; also sheet 8
DATA7: IC44.9(A8) IC45.9(A8) ; also sheet 8
DATA8: IC40.2(A1) ; also sheet 8
DATA9: IC40.3(A2) ; also sheet 8
DATA10: IC40.4(A3) ; also sheet 8
DATA11: IC40.5(A4) ; also sheet 8
DATA12: IC40.6(A5) ; also sheet 8
DATA13: IC40.7(A6) ; also sheet 8
DATA14: IC40.8(A7) ; also sheet 8
DATA15: IC40.9(A8) ; also sheet 8
GND: IC48.13(5D) IC48.14(6D) IC48.17(7D) IC48.18(8D) ; also sheet 6,7,8
H/L-SWAP: IC11.10(C:I1) IC42.11(E:I) ; also sheet 8
IREG0: IC42.6(C:O) ; also sheet 2
IREG1: IC42.8(D:O) ; also sheet 4
N$1: IC42.12(F:O) IC49.9(C:I0)
N$19: IC2.3(A:O) IC48.11(CLK)
N$24: IC2.1(A:I0) IC2.2(A:I1) IC2.11(D:O)
N$37: IC11.4(B:I0) IC11.5(B:I1) IC41.1(A:G) IC49.8(C:O)
N$41: IC49.6(B:O) IC49.10(C:I1)
N$42: IC11.11(D:O) IC40.19(G) IC45.19(G)
N$43: IC41.12(B:Y0) IC48.3(1D)
N$44: IC11.8(C:O) IC44.19(G)
N$45: IC11.12(D:I0) IC42.10(E:O)
N$46: IC41.11(B:Y1) IC48.4(2D)
N$47: IC48.1(OC) IC49.11(D:O)
N$48: IC41.10(B:Y2) IC48.7(3D)
N$49: IC41.9(B:Y3) IC48.8(4D)
N$50: IC2.6(B:O) IC49.13(D:I1)
PC: IC42.2(A:O) ; also sheet 3
RD-OR-LD: IC42.13(F:I) IC49.3(A:O)
SP: IC42.4(B:O) ; also sheet 1
UNUSED1: 0.1 1.1 IC11.1(A:I0) IC11.2(A:I1) ; also sheet 8
VCC: R2.2 R3.2 R4.2 R5.2 ; also sheet 7,8
Unconnected: IC48.12(5Q) IC48.15(6Q) IC48.16(7Q) IC48.19(8Q)

### Buses
ADATA[0..7]
ADATA[8..15]
DATA[0..15]

### Notes on the sheet
- hi a to b
- change to addr-id-2

## Sheet 6 of 8: Front Panel
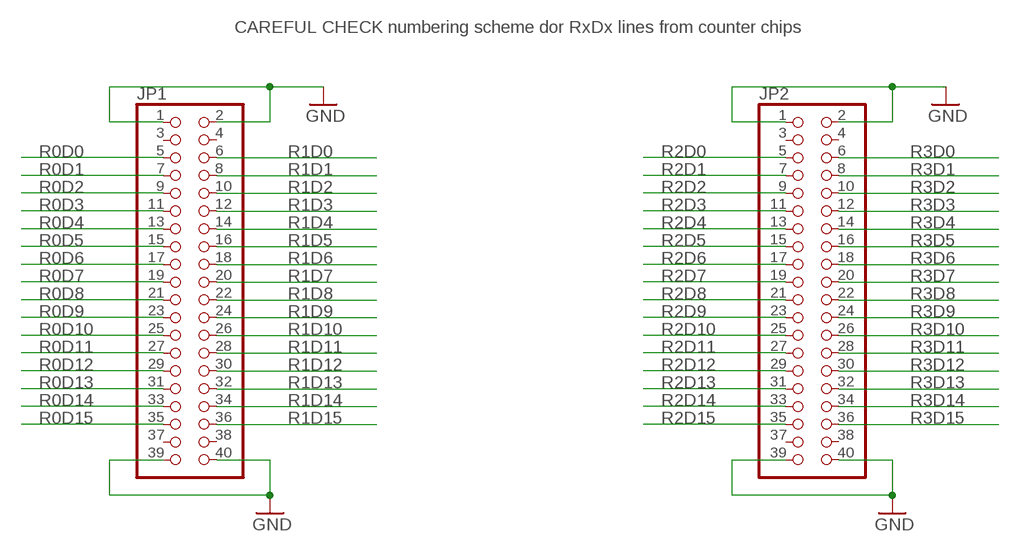
[diagram p5: schematic, sheet 6]

### Parts
JP1  PINHD-2X20  [2X20]
JP2  PINHD-2X20  [2X20]

### Nets
GND: JP1.1 JP1.2 JP1.39 JP1.40 JP2.1 JP2.2 JP2.39 JP2.40 ; also sheet 5,7,8
R0D0: JP1.5 ; also sheet 1
R0D1: JP1.7 ; also sheet 1
R0D2: JP1.9 ; also sheet 1
R0D3: JP1.11 ; also sheet 1
R0D4: JP1.13 ; also sheet 1
R0D5: JP1.15 ; also sheet 1
R0D6: JP1.17 ; also sheet 1
R0D7: JP1.19 ; also sheet 1
R0D8: JP1.21 ; also sheet 1
R0D9: JP1.23 ; also sheet 1
R0D10: JP1.25 ; also sheet 1
R0D11: JP1.27 ; also sheet 1
R0D12: JP1.29 ; also sheet 1
R0D13: JP1.31 ; also sheet 1
R0D14: JP1.33 ; also sheet 1
R0D15: JP1.35 ; also sheet 1
R1D0: JP1.6 ; also sheet 3
R1D1: JP1.8 ; also sheet 3
R1D2: JP1.10 ; also sheet 3
R1D3: JP1.12 ; also sheet 3
R1D4: JP1.14 ; also sheet 3
R1D5: JP1.16 ; also sheet 3
R1D6: JP1.18 ; also sheet 3
R1D7: JP1.20 ; also sheet 3
R1D8: JP1.22 ; also sheet 3
R1D9: JP1.24 ; also sheet 3
R1D10: JP1.26 ; also sheet 3
R1D11: JP1.28 ; also sheet 3
R1D12: JP1.30 ; also sheet 3
R1D13: JP1.32 ; also sheet 3
R1D14: JP1.34 ; also sheet 3
R1D15: JP1.36 ; also sheet 3
R2D0: JP2.5 ; also sheet 2
R2D1: JP2.7 ; also sheet 2
R2D2: JP2.9 ; also sheet 2
R2D3: JP2.11 ; also sheet 2
R2D4: JP2.13 ; also sheet 2
R2D5: JP2.15 ; also sheet 2
R2D6: JP2.17 ; also sheet 2
R2D7: JP2.19 ; also sheet 2
R2D8: JP2.21 ; also sheet 2
R2D9: JP2.23 ; also sheet 2
R2D10: JP2.25 ; also sheet 2
R2D11: JP2.27 ; also sheet 2
R2D12: JP2.29 ; also sheet 2
R2D13: JP2.31 ; also sheet 2
R2D14: JP2.33 ; also sheet 2
R2D15: JP2.35 ; also sheet 2
R3D0: JP2.6 ; also sheet 4
R3D1: JP2.8 ; also sheet 4
R3D2: JP2.10 ; also sheet 4
R3D3: JP2.12 ; also sheet 4
R3D4: JP2.14 ; also sheet 4
R3D5: JP2.16 ; also sheet 4
R3D6: JP2.18 ; also sheet 4
R3D7: JP2.20 ; also sheet 4
R3D8: JP2.22 ; also sheet 4
R3D9: JP2.24 ; also sheet 4
R3D10: JP2.26 ; also sheet 4
R3D11: JP2.28 ; also sheet 4
R3D12: JP2.30 ; also sheet 4
R3D13: JP2.32 ; also sheet 4
R3D14: JP2.34 ; also sheet 4
R3D15: JP2.36 ; also sheet 4
Unconnected: JP1.3 JP1.4 JP1.37 JP1.38 JP2.3 JP2.4 JP2.37 JP2.38

### Notes on the sheet
- CAREFUL CHECK numbering scheme dor RxDx lines from counter chips

## Sheet 7 of 8: PULLUPS & BYPASS & UNUSED
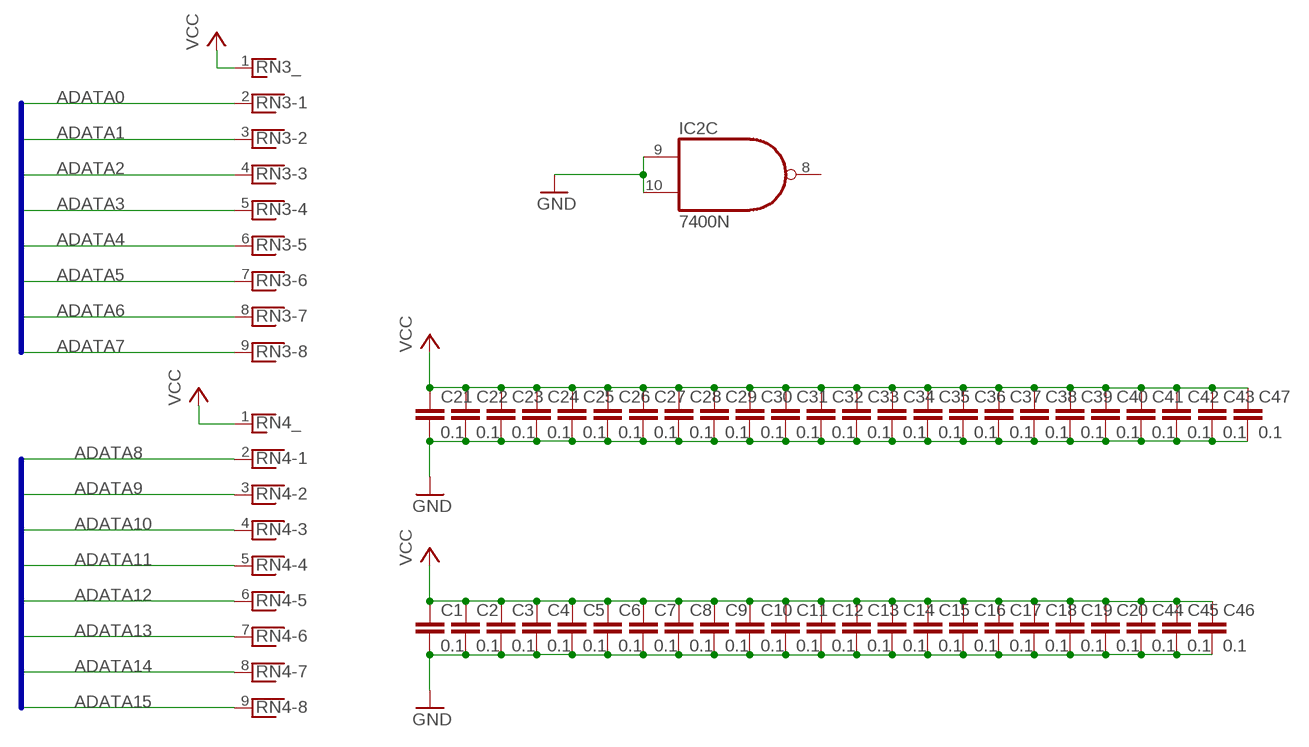
[diagram p6: schematic, sheet 7]

### Parts
C1  0.1  C2.5/2  [C2.5-2]
C2  0.1  C2.5/2  [C2.5-2]
C3  0.1  C2.5/2  [C2.5-2]
C4  0.1  C2.5/2  [C2.5-2]
C5  0.1  C2.5/2  [C2.5-2]
C6  0.1  C2.5/2  [C2.5-2]
C7  0.1  C2.5/2  [C2.5-2]
C8  0.1  C2.5/2  [C2.5-2]
C9  0.1  C2.5/2  [C2.5-2]
C10  0.1  C2.5/2  [C2.5-2]
C11  0.1  C2.5/2  [C2.5-2]
C12  0.1  C2.5/2  [C2.5-2]
C13  0.1  C2.5/2  [C2.5-2]
C14  0.1  C2.5/2  [C2.5-2]
C15  0.1  C2.5/2  [C2.5-2]
C16  0.1  C2.5/2  [C2.5-2]
C17  0.1  C2.5/2  [C2.5-2]
C18  0.1  C2.5/2  [C2.5-2]
C19  0.1  C2.5/2  [C2.5-2]
C20  0.1  C2.5/2  [C2.5-2]
C21  0.1  C2.5/2  [C2.5-2]
C22  0.1  C2.5/2  [C2.5-2]
C23  0.1  C2.5/2  [C2.5-2]
C24  0.1  C2.5/2  [C2.5-2]
C25  0.1  C2.5/2  [C2.5-2]
C26  0.1  C2.5/2  [C2.5-2]
C27  0.1  C2.5/2  [C2.5-2]
C28  0.1  C2.5/2  [C2.5-2]
C29  0.1  C2.5/2  [C2.5-2]
C30  0.1  C2.5/2  [C2.5-2]
C31  0.1  C2.5/2  [C2.5-2]
C32  0.1  C2.5/2  [C2.5-2]
C33  0.1  C2.5/2  [C2.5-2]
C34  0.1  C2.5/2  [C2.5-2]
C35  0.1  C2.5/2  [C2.5-2]
C36  0.1  C2.5/2  [C2.5-2]
C37  0.1  C2.5/2  [C2.5-2]
C38  0.1  C2.5/2  [C2.5-2]
C39  0.1  C2.5/2  [C2.5-2]
C40  0.1  C2.5/2  [C2.5-2]
C41  0.1  C2.5/2  [C2.5-2]
C42  0.1  C2.5/2  [C2.5-2]
C43  0.1  C2.5/2  [C2.5-2]
C44  0.1  C2.5/2  [C2.5-2]
C45  0.1  C2.5/2  [C2.5-2]
C46  0.1  C2.5/2  [C2.5-2]
C47  0.1  C2.5/2  [C2.5-2]
RN3  RNX8  [RN-9]
RN4  RNX8  [RN-9]

### Nets
ADATA0: RN3.2 ; also sheet 1,2,3,4,5
ADATA1: RN3.3 ; also sheet 1,2,3,4,5
ADATA2: RN3.4 ; also sheet 1,2,3,4,5
ADATA3: RN3.5 ; also sheet 1,2,3,4,5
ADATA4: RN3.6 ; also sheet 1,2,3,4,5
ADATA5: RN3.7 ; also sheet 1,2,3,4,5
ADATA6: RN3.8 ; also sheet 1,2,3,4,5
ADATA7: RN3.9 ; also sheet 1,2,3,4,5
ADATA8: RN4.2 ; also sheet 1,2,3,4,5
ADATA9: RN4.3 ; also sheet 1,2,3,4,5
ADATA10: RN4.4 ; also sheet 1,2,3,4,5
ADATA11: RN4.5 ; also sheet 1,2,3,4,5
ADATA12: RN4.6 ; also sheet 1,2,3,4,5
ADATA13: RN4.7 ; also sheet 1,2,3,4,5
ADATA14: RN4.8 ; also sheet 1,2,3,4,5
ADATA15: RN4.9 ; also sheet 1,2,3,4,5
GND: C1.2 C2.2 C3.2 C4.2 C5.2 C6.2 C7.2 C8.2 C9.2 C10.2 C11.2 C12.2 C13.2 C14.2 C15.2 C16.2 C17.2 C18.2 C19.2 C20.2 C21.2 C22.2 C23.2 C24.2 C25.2 C26.2 C27.2 C28.2 C29.2 C30.2 C31.2 C32.2 C33.2 C34.2 C35.2 C36.2 C37.2 C38.2 C39.2 C40.2 C41.2 C42.2 C43.2 C44.2 C45.2 C46.2 C47.2 IC2.9(C:I0) IC2.10(C:I1) ; also sheet 5,6,8
VCC: C1.1 C2.1 C3.1 C4.1 C5.1 C6.1 C7.1 C8.1 C9.1 C10.1 C11.1 C12.1 C13.1 C14.1 C15.1 C16.1 C17.1 C18.1 C19.1 C20.1 C21.1 C22.1 C23.1 C24.1 C25.1 C26.1 C27.1 C28.1 C29.1 C30.1 C31.1 C32.1 C33.1 C34.1 C35.1 C36.1 C37.1 C38.1 C39.1 C40.1 C41.1 C42.1 C43.1 C44.1 C45.1 C46.1 C47.1 RN3.1 RN4.1 ; also sheet 5,8
Unconnected: IC2.8(C:O)

### Buses
ADATA[0..7]
ADATA[8..15]

## Sheet 8 of 8: BUS
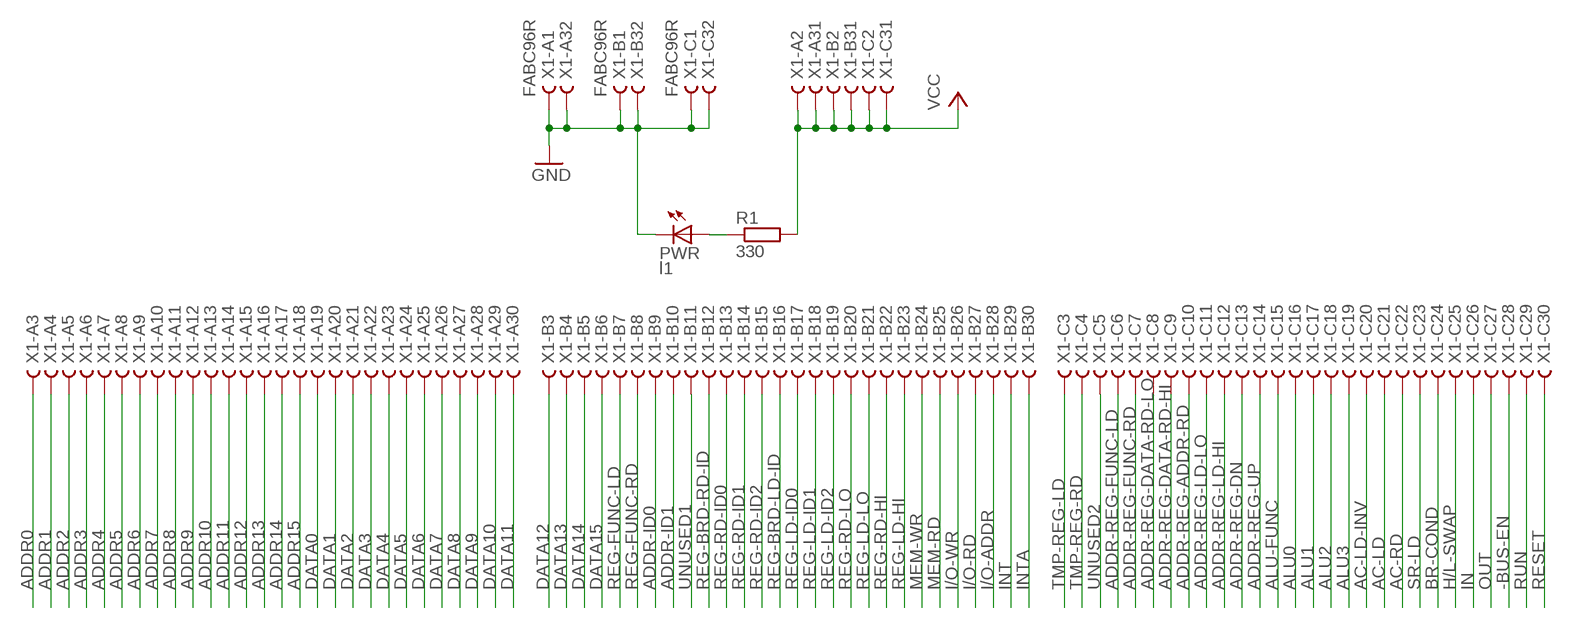
[diagram p7: schematic, sheet 8]

### Parts
PWR  l1  LED5MM  [LED5MM]
R1  330  R0207/10  [0207/10]
X1  FABC96R  [FABC96R]

### Nets
-BUS-EN: X1.C28 ; also sheet 5
AC-LD: X1.C21
AC-LD-INV: X1.C20
AC-RD: X1.C22
ADDR0: X1.A3 ; also sheet 1,2,3,4
ADDR1: X1.A4 ; also sheet 1,2,3,4
ADDR2: X1.A5 ; also sheet 1,2,3,4
ADDR3: X1.A6 ; also sheet 1,2,3,4
ADDR4: X1.A7 ; also sheet 1,2,3,4
ADDR5: X1.A8 ; also sheet 1,2,3,4
ADDR6: X1.A9 ; also sheet 1,2,3,4
ADDR7: X1.A10 ; also sheet 1,2,3,4
ADDR8: X1.A11 ; also sheet 1,2,3,4
ADDR9: X1.A12 ; also sheet 1,2,3,4
ADDR10: X1.A13 ; also sheet 1,2,3,4
ADDR11: X1.A14 ; also sheet 1,2,3,4
ADDR12: X1.A15 ; also sheet 1,2,3,4
ADDR13: X1.A16 ; also sheet 1,2,3,4
ADDR14: X1.A17 ; also sheet 1,2,3,4
ADDR15: X1.A18 ; also sheet 1,2,3,4
ADDR-ID0: X1.B9 ; also sheet 5
ADDR-ID1: X1.B10 ; also sheet 5
ADDR-REG-ADDR-RD: X1.C10 ; also sheet 5
ADDR-REG-DATA-RD-HI: X1.C9 ; also sheet 1,2,3,4
ADDR-REG-DATA-RD-LO: X1.C8 ; also sheet 1,2,3,4
ADDR-REG-DN: X1.C13 ; also sheet 1,2,3,4
ADDR-REG-FUNC-LD: X1.C6 ; also sheet 5
ADDR-REG-FUNC-RD: X1.C7 ; also sheet 5
ADDR-REG-LD-HI: X1.C12 ; also sheet 1,2,3,4
ADDR-REG-LD-LO: X1.C11 ; also sheet 1,2,3,4
ADDR-REG-UP: X1.C14 ; also sheet 1,2,3,4
ALU0: X1.C16
ALU1: X1.C17
ALU2: X1.C18
ALU3: X1.C19
ALU-FUNC: X1.C15
BR-COND: X1.C24
DATA0: X1.A19 ; also sheet 5
DATA1: X1.A20 ; also sheet 5
DATA2: X1.A21 ; also sheet 5
DATA3: X1.A22 ; also sheet 5
DATA4: X1.A23 ; also sheet 5
DATA5: X1.A24 ; also sheet 5
DATA6: X1.A25 ; also sheet 5
DATA7: X1.A26 ; also sheet 5
DATA8: X1.A27 ; also sheet 5
DATA9: X1.A28 ; also sheet 5
DATA10: X1.A29 ; also sheet 5
DATA11: X1.A30 ; also sheet 5
DATA12: X1.B3 ; also sheet 5
DATA13: X1.B4 ; also sheet 5
DATA14: X1.B5 ; also sheet 5
DATA15: X1.B6 ; also sheet 5
GND: PWR.K(C) X1.A1 X1.A32 X1.B1 X1.B32 X1.C1 X1.C32 ; also sheet 5,6,7
H/L-SWAP: X1.C25 ; also sheet 5
I/O-ADDR: X1.B28
I/O-RD: X1.B27
I/O-WR: X1.B26
IN: X1.C26
INT: X1.B29
INTA: X1.B30
MEM-RD: X1.B25
MEM-WR: X1.B24
N$51: PWR.A R1.1
OUT: X1.C27
REG-BRD-LD-ID: X1.B16
REG-BRD-RD-ID: X1.B12
REG-FUNC-LD: X1.B7
REG-FUNC-RD: X1.B8
REG-LD-HI: X1.B23
REG-LD-ID0: X1.B17
REG-LD-ID1: X1.B18
REG-LD-ID2: X1.B19
REG-LD-LO: X1.B21
REG-RD-HI: X1.B22
REG-RD-ID0: X1.B13
REG-RD-ID1: X1.B14
REG-RD-ID2: X1.B15
REG-RD-LO: X1.B20
RESET: X1.C30 ; also sheet 1,2,3,4
RUN: X1.C29
SR-LD: X1.C23
TMP-REG-LD: X1.C3
TMP-REG-RD: X1.C4
UNUSED1: X1.B11 ; also sheet 5
UNUSED2: X1.C5
VCC: R1.2 X1.A2 X1.A31 X1.B2 X1.B31 X1.C2 X1.C31 ; also sheet 5,7

## Power pins joined to a net without a drawn wire
GND: IC1.7(P:GND) IC2.7(P:GND) IC3.8(GND) IC4.8(GND) IC5.8(GND) IC6.8(GND) IC7.10(P:GND) IC8.10(P:GND) IC9.10(P:GND) IC10.10(P:GND) IC11.7(P:GND) IC12.7(P:GND) IC13.8(GND) IC14.8(GND) IC15.8(GND) IC16.8(GND) IC17.10(P:GND) IC18.10(P:GND) IC19.10(P:GND) IC20.10(P:GND) IC21.8(GND) IC22.8(GND) IC23.8(GND) IC24.8(GND) IC25.10(P:GND) IC26.10(P:GND) IC27.10(P:GND) IC28.10(P:GND) IC29.7(P:GND) IC30.7(P:GND) IC31.8(GND) IC32.8(GND) IC33.8(GND) IC34.8(GND) IC35.10(P:GND) IC36.10(P:GND) IC37.10(P:GND) IC38.10(P:GND) IC39.7(P:GND) IC40.10(GND) IC41.8(P:GND) IC42.7(P:GND) IC43.7(P:GND) IC44.10(GND) IC45.10(GND) IC48.10(GND) IC49.7(P:GND)
VCC: IC1.14(P:VCC) IC2.14(P:VCC) IC3.16(VCC) IC4.16(VCC) IC5.16(VCC) IC6.16(VCC) IC7.20(P:VCC) IC8.20(P:VCC) IC9.20(P:VCC) IC10.20(P:VCC) IC11.14(P:VCC) IC12.14(P:VCC) IC13.16(VCC) IC14.16(VCC) IC15.16(VCC) IC16.16(VCC) IC17.20(P:VCC) IC18.20(P:VCC) IC19.20(P:VCC) IC20.20(P:VCC) IC21.16(VCC) IC22.16(VCC) IC23.16(VCC) IC24.16(VCC) IC25.20(P:VCC) IC26.20(P:VCC) IC27.20(P:VCC) IC28.20(P:VCC) IC29.14(P:VCC) IC30.14(P:VCC) IC31.16(VCC) IC32.16(VCC) IC33.16(VCC) IC34.16(VCC) IC35.20(P:VCC) IC36.20(P:VCC) IC37.20(P:VCC) IC38.20(P:VCC) IC39.14(P:VCC) IC40.20(VCC) IC41.16(P:VCC) IC42.14(P:VCC) IC43.14(P:VCC) IC44.20(VCC) IC45.20(VCC) IC48.20(VCC) IC49.14(P:VCC)

## Library data of the parts
0 1 = SparkFun-Connectors:M03: Header 3 Standard 3-pin 0.1" header. Use with straight break away headers (SKU : PRT-00116), right angle break away headers (PRT-00553), swiss pins (PRT-00743), machine pins (PRT-00117), and female headers (PRT-00115). Molex polarized connector foot print use with SKU : PRT-08232 with associated crimp pins and housings.
C1-C47 = capacitor-wima:C: CAPACITOR naming: grid - package width
IC1 IC2 IC11 IC12 IC29 IC30 IC39 IC43 = 74xx-us:74*00: Quad 2-input NAND gate
IC3-IC6 IC13-IC16 IC21-IC24 IC31-IC34 = 74xx-us:74*192: Synchronous 4-bit UP/DOWN COUNTER
IC7-IC10 IC17-IC20 IC25-IC28 IC35-IC38 = 74xx-us:74*244: Octal BUFFER and LINE DRIVER, 3-state
IC40 IC44 IC45 = 74xx-us:74*245: Octal BUS TRANSCEIVER, 3-state
IC41 = 74xx-us:74*139: Dual 2-line to 4-line DECODER/DEMULTIPLEXER
IC42 = 74xx-us:74*04: Hex INVERTER
IC48 = 74xx-us:74*374: Octal D type transparent LATCH, edge triggered
IC49 = 74xx-us:74*32: Quad 2-input OR gate
JP1 JP2 = pinhead:PINHD-2X20: PIN HEADER
PWR = led:LED: LED OSRAM: - CHIPLED LG R971, LG N971, LY N971, LG Q971, LY Q971, LO R971, LY R971 LH N974, LH R974 LS Q976, LO Q976, LY Q976 LO Q996 - Hyper CHIPLED LW Q18S LB Q993, LB Q99A, LB R99A - SideLED LS A670, LO A670, LY A670, LG A670, LP A670 LB A673, LV A673, LT A673, LW A673 LH A674 LY A675 LS A676, LA A676, LO A676, LY A676, LW A676 LS A679, LY A679, LG A679 - Hyper Micro SIDELED® LS Y876, LA Y876, LO Y876, LY Y876 LT Y87S - SmartLED LW L88C, LW L88S LB L89C, LB L89S, LG L890 LS L89K, LO L89K, LY L89K LS L896, LA L896, LO L896, LY L896 - TOPLED LS T670, LO T670, LY T670, LG T670, LP T670 LSG T670, LSP T670, LSY T670, LOP T670, LYG T670 LG T671, LOG T671, LSG T671 LB T673, LV T673, LT T673, LW T673 LH T674 LS T676, LA T676, LO T676, LY T676, LB T676, LH T676, LSB T676, LW T676 LB T67C, LV T67C, LT T67C, LS T67K, LO T67K, LY T67K, LW E67C LS E67B, LA E67B, LO E67B, LY E67B, LB E67C, LV E67C, LT E67C LW T67C LS T679, LY T679, LG T679 LS T770, LO T770, LY T770, LG T770, LP T770 LB T773, LV T773, LT T773, LW T773 LH T774 LS E675, LA E675, LY E675, LS T675 LS T776, LA T776, LO T776, LY T776, LB T776 LHGB T686 LT T68C, LB T68C - Hyper Mini TOPLED® LB M676 - Mini TOPLED Santana® LG M470 LS M47K, LO M47K, LY M47K Source: http://www.osram.convergy.de LUXEON: - LUMILED® LXK2-PW12-R00, LXK2-PW12-S00, LXK2-PW14-U00, LXK2-PW14-V00 LXK2-PM12-R00, LXK2-PM12-S00, LXK2-PM14-U00 LXK2-PE12-Q00, LXK2-PE12-R00, LXK2-PE12-S00, LXK2-PE14-T00, LXK2-PE14-U00 LXK2-PB12-K00, LXK2-PB12-L00, LXK2-PB12-M00, LXK2-PB14-N00, LXK2-PB14-P00, LXK2-PB14-Q00 LXK2-PR12-L00, LXK2-PR12-M00, LXK2-PR14-Q00, LXK2-PR14-R00 LXK2-PD12-Q00, LXK2-PD12-R00, LXK2-PD12-S00 LXK2-PH12-R00, LXK2-PH12-S00 LXK2-PL12-P00, LXK2-PL12-Q00, LXK2-PL12-R00 Source: www.luxeon.com KINGBRIGHT: KA-3528ASYC Source: www.kingbright.com
R1 = eagle-ltspice:R: RESISTOR, European symbol; SPICEMODEL: NONE; SPICEPREFIX: R
R2-R5 = resistor:R-US_: RESISTOR, American symbol
RN3 RN4 = resistor-net:RNX8: RESISTOR NETWORK; OC_FARNELL: unknown; OC_NEWARK: unknown
X1 = con-vg:FABC96R: CONNECTOR female, 96 pins, type R, rows ABC, grid 2.54 mm